# Altium schematic sheet Sheet1.SchDoc: ABC
size A4; DrawnBy: AC; Revision: V3; SheetNumber: 2; SheetTotal: 2; For: 123
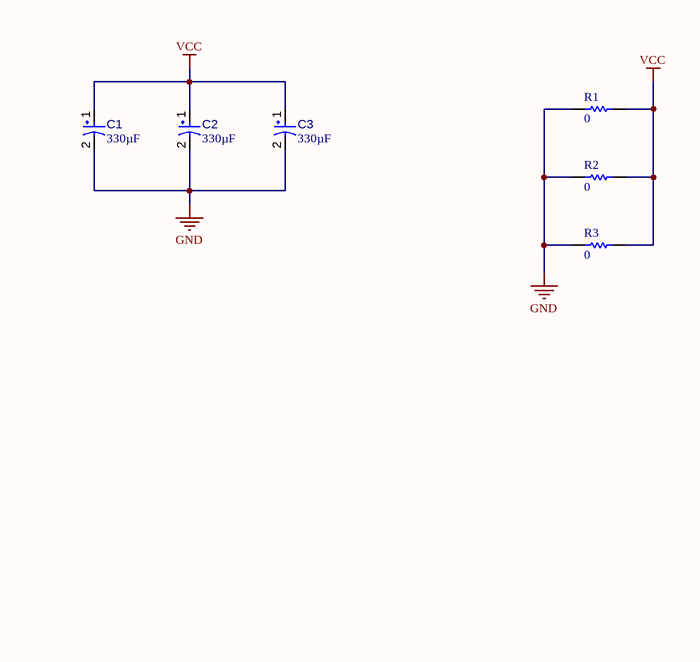
[diagram p0: Sheet1.SchDoc]

## Parts
C1  value 330µF  [PNSC-6TPF220M5L]  (hidden comment: Capacitor 330µF +/-20% 6.3V D3)
C2  value 330µF  [PNSC-6TPF220M5L]  (hidden comment: Capacitor 330µF +/-20% 6.3V D3)
C3  value 330µF  [PNSC-6TPF220M5L]  (hidden comment: Capacitor 330µF +/-20% 6.3V D3)
R1  value 0  [RESC3216X60X45ML15T20]  (hidden comment: Resistor 0R +/- 5% 1206 250 mW)
R2  value 0  [RESC3216X60X45ML15T20]  (hidden comment: Resistor 0R +/- 5% 1206 250 mW)
R3  value 0  [RESC3216X60X45ML15T20]  (hidden comment: Resistor 0R +/- 5% 1206 250 mW)

## Nets
GND: C1.2 C2.2 C3.2 R1.1 R2.1 R3.1
VCC: C1.1 C2.1 C3.1 R1.2 R2.2 R3.2

## Notes on the sheet
- Text
- Title
- For
- Prod No.
- LCS
- Drawn:
- Size:
- A4
- Number:
- Checked:
- Revision:
- Approved:
- CONTROLS PVT LTD
- Partner in Weighing
- THIS DRAWING IS THE PROPERTY OF
- OR COPIED WITHOUT PERMISSION.
- LCS CONTROLS AND  IS NOT TO BE
- and Automation
- Issue No.
- DATE
- RELEASED FOR:
- MANUFACT
- Date:
- Sheet
- of

## Library data of the parts
C1-C3 = CMP-001-00058-3: Molded Tantalum Polymer Capacitor, 330 uF, +/- 20%, 6.3 V, -55 to 105 degC, 2-Pin SMD, RoHS, Tape and Reel; Voltage Rating: 6.3V; Min Operating Temperature: -55°C; Tolerance: 20%; Pins: 2; Case/Package: 1210; Max Operating Temperature: 105°C; Mounting Technology: SMT
R1-R3 = CMP-009-00002-5: Chip Resistor, 0 Ohm, +/- 5%, 0.25 W, -55 to 155 degC, 1206 (3216 Metric); Voltage Rating: 200V; Power: 250mW; Tolerance: 5%; Min Operating Temperature: -55°C; Mounting Technology: SM; Max Operating Temperature: 155°C; Case/Package: 1206; RoHS Compliant: True; Pins: 2